# EAGLE design isp_2 (EAGLE 6.3)
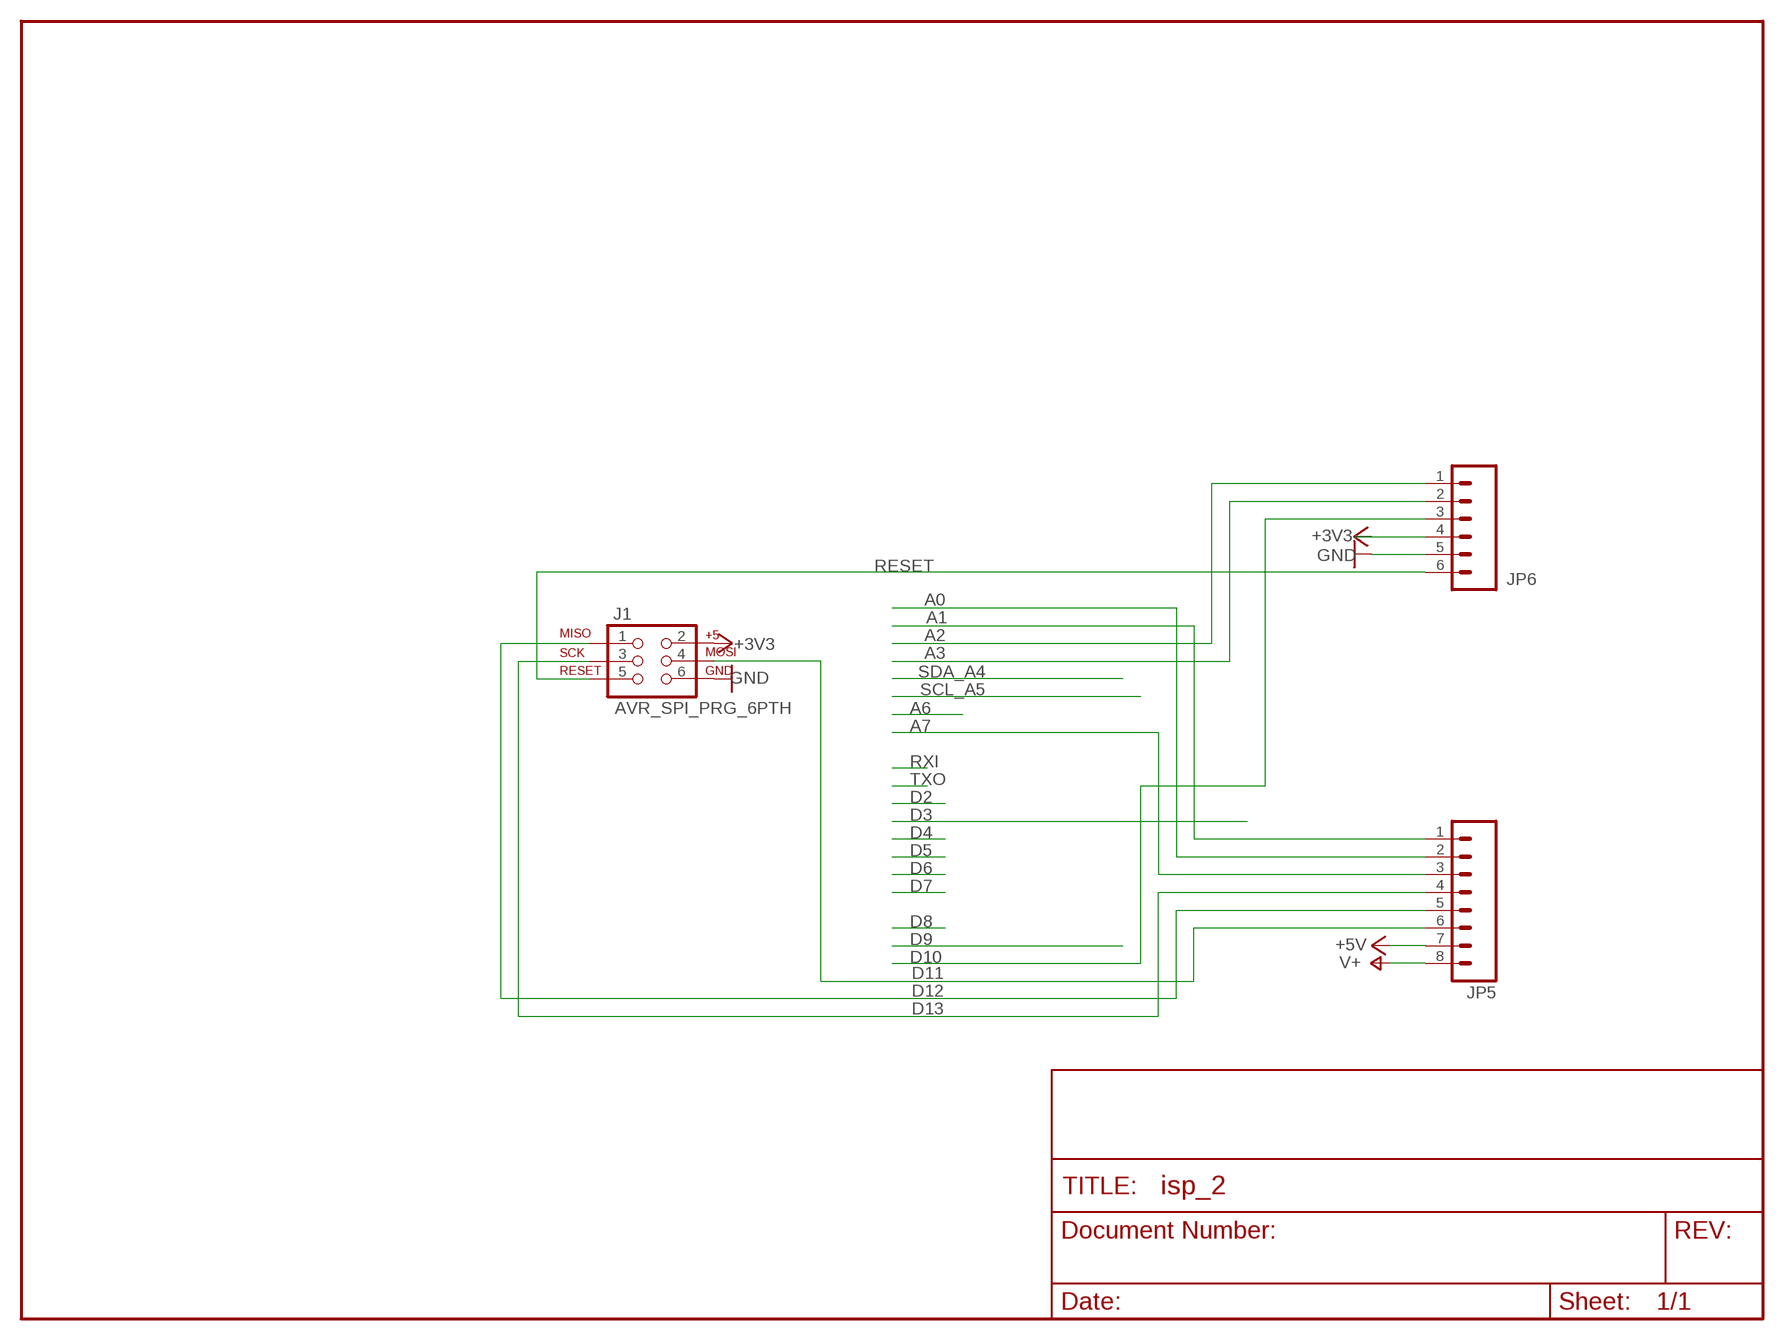
[diagram p0: schematic, sheet 1]

## Parts
J1  AVR_SPI_PRG_6PTH  [2X3]
JP5  M081X08  [1X08]
JP6  M06SIP  [1X06]

## Nets
+3V3: J1.2 JP6.4
+5V: JP5.7
A0: JP5.2
A1: JP5.1
A2: JP6.1
A3: JP6.2
A7: JP5.3
D10: JP6.3
D11: J1.4 JP5.6
D12: J1.1 JP5.5
D13: J1.3 JP5.4
GND: J1.6 JP6.5
RESET: J1.5 JP6.6
V+: JP5.8

## Library data of the parts
J1 = SparkFun:AVR_SPI_PRG_6: AVR ISP 6 Pin This is the reduced ISP connector for AVR programming. Common on Arduino. This footprint will take up less PCB space and can be used with a 10-pin to 6-pin adapter such as SKU: BOB-08508
JP5 = SparkFun_mod:M08: Header 8 Standard 8-pin 0.1" header. Use with straight break away headers (SKU : PRT-00116), right angle break away headers (PRT-00553), swiss pins (PRT-00743), machine pins (PRT-00117), and female headers (PRT-00115).
JP6 = SparkFun:M06: Header 6 Standard 6-pin 0.1" header. Use with straight break away headers (SKU : PRT-00116), right angle break away headers (PRT-00553), swiss pins (PRT-00743), machine pins (PRT-00117), and female headers (PRT-00115). Molex polarized connector foot print use with SKU : PRT-08094 with associated crimp pins and housings. NOTES ON THE VARIANTS LOCK and LOCK_LONGPADS... This footprint was designed to help hold the alignment of a through-hole component (i.e. 6-pin header) while soldering it into place. You may notice that each hole has been shifted either up or down by 0.005 of an inch from it's more standard position (which is a perfectly straight line). This slight alteration caused the pins (the squares in the middle) to touch the edges of the holes. Because they are alternating, it causes a "brace" to hold the component in place. 0.005 has proven to be the perfect amount of "off-center" position when using our standard breakaway headers. Although looks a little odd when you look at the bare footprint, once you have a header in there, the alteration is very hard to notice. Also, if you push a header all the way into place, it is covered up entirely on the bottom side. This idea of altering the position of holes to aid alignment will be further integrated into the Sparkfun Library for other footprints. It can help hold any component with 3 or more connection pins.

## Net classes
0 default: width 0.203 mm
1 vcc: width 0.254 mm

## Board
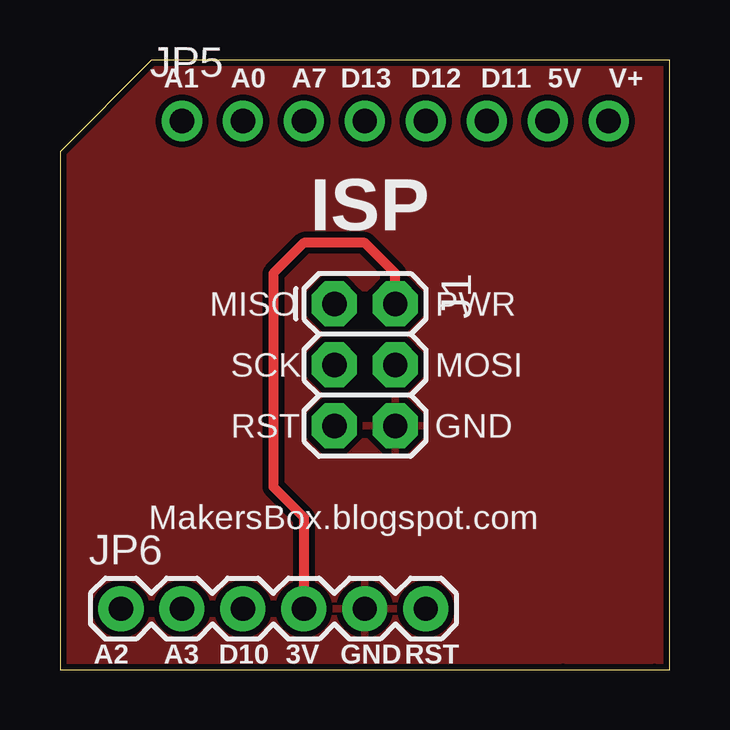
[diagram p1: board, top side]
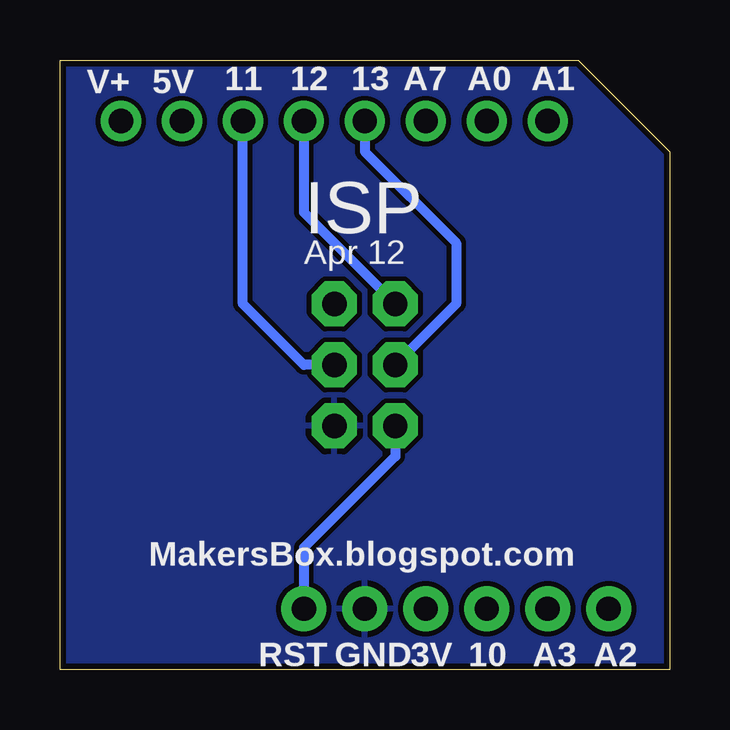
[diagram p2: board, bottom side, seen from below]

Size 25.4 x 25.4 mm. Coordinates in mm from the lower left corner, seen from the top.
Outline: 25.4,25.4 25.4,21.59 25.4,0 24.77,0 20.96,0 0,0 0,21.59
Outline: 25.4,25.4 3.81,25.4 0,21.59
Outline: 0,21.59 0,21.59
Copper layers (1*16): Top 0.035mm / dielectric 1.5mm / Bottom 0.035mm
Design rules "SparkFun": minimum track width 8mil, minimum drill 20mil, track to track 8mil, track to pad 8mil, pad to pad 8mil, via to via 8mil, smd to smd 8mil, copper to edge 10mil, drill to drill 8mil, minimum pad ring 12mil, minimum via ring 10mil, stop-mask expansion 4mil, vias tented up to drill 25mil, thermal gap 10mil

### Footprints (pad centres in the part's own frame; a part is rotated, then mirrored left to right if it is on the bottom)
2X3 = drill 1.016 pad 1.88 octagon: 1 0,0; 2 0,2.54; 3 2.54,0; 4 2.54,2.54; 5 5.08,0; 6 5.08,2.54
1X08 = drill 1.016 pad 1.676: 1 0,0; 2 2.54,0; 3 5.08,0; 4 7.62,0; 5 10.16,0; 6 12.7,0; 7 15.24,0; 8 17.78,0
1X06 = drill 1.016 pad 1.88: 1 0,0; 2 2.54,0; 3 5.08,0; 4 7.62,0; 5 10.16,0; 6 12.7,0

### Placement (x,y rotation side)
J1  11.43,15.24 270 top
JP5  5.08,22.86 0 top
JP6  2.54,2.54 0 top

### Tracks (layer width: path | path; a pad name or v marks a point on that pad's centre or on a via)
+3V3
  Top 0.406: J1.2 13.97,16.51 12.7,17.78 10.16,17.78 8.89,16.51 8.89,7.62 10.16,6.35 JP6.4
D11
  Bottom 0.406: J1.4 15.24,12.7 17.78,15.24 JP5.6
D12
  Bottom 0.406: JP5.5 15.24,19.05 J1.1
D13
  Bottom 0.406: JP5.4 12.7,21.59 8.89,17.78 8.89,15.24 J1.3
GND
  pour Bottom: -1.27,26.67 26.67,26.67 26.67,-1.27 -1.27,-1.27
  pour Top (isolate 0.254): -0.64,26.04 26.67,26.04 26.67,0 26.04,-0.64 -0.64,-0.64
RESET
  Bottom 0.406: J1.5 11.43,8.89 15.24,5.08 JP6.6

### Text on the board
tPlace: A1 | A0 | A7 | D13 | D12 | D11 | 5V | V+ | ISP | MISO | PWR | SCK | MOSI | RST | GND | MakersBox.blogspot.com | A2 | A3 | D10 | 3V | GND | RST
bPlace: A1 | A0 | A7 | 13 | 12 | 5V | V+ | 11 | ISP | Apr 12 | MakersBox.blogspot.com | A2 | A3 | 10 | 3V | GND | RST